# Altium schematic sheet 03.Template_Debug.SchDoc
size 209 x 297 mm; Author: Мурашкин Д.В.; CompanyName: Innoforce.kz; DocumentNumber: AB_BUSM_D01.R1; SheetNumber: 9; SheetTotal: 20; Scale: 1:1; Letter1Column: Э; PartName: Разъём программирования и отладки; DocumentsNumber: AB_BUSM_D01.R1
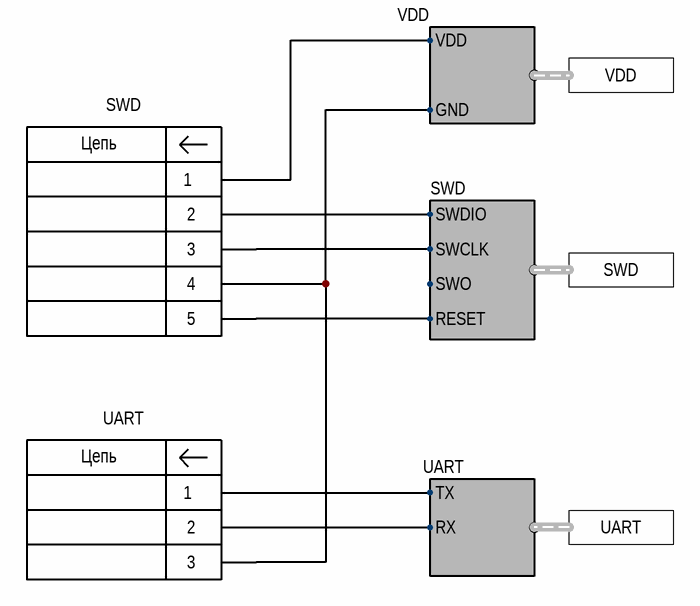
[diagram p0: 03.Template_Debug.SchDoc]

## Parts
SWD  SWDR-2.54-5  [SWDR-2.54-5]  (value not drawn)  (no BOM)
UART  UART-2.54-3  [UART-2.54-3]  (value not drawn)  (no BOM)

## Ports
SWD (harness SWD), UART (harness UART), VDD (harness VDD)

## Harnesses
SWD: SWCLK, SWO, SWDIO, RESET
VDD: VDD, GND
UART: TX, RX

## Nets
NetSWD_1: SWD.1 ; port VDD.VDD
NetSWD_2: SWD.2 ; port SWD.SWDIO
NetSWD_3: SWD.3 ; port SWD.SWCLK
NetSWD_4: SWD.4 UART.3 ; port VDD.GND
NetSWD_5: SWD.5 ; port SWD.RESET
NetUART_1: UART.1 ; port UART.TX
NetUART_2: UART.2 ; port UART.RX

## Notes on the sheet
- Подп. и дата
- Инв. № дубл.
- Взам. инв. №
- Инв. № подл.
- Изм.
- Лист
- № докум.
- Подп.
- Дата
- 2.106-A4
- Копировал
- Формат А4
- (in symbol SWDR-2.54-5) Цепь
- (in symbol UART-2.54-3) Цепь

## Library data of the parts
SWD = SWDR-2.54-5: Connector Debug SWD + Reset PCB-PAD-2.54-5; Pitch: 2.54; Row spacing: 0; Positions: 5; Rows: 1; Placing: Vertical; Connector type: Board pads; Connector style: Board; Shrouding: Not; Group: Mechanical; Component: Connectors; Item ID: SWDR-2.54-5; Part name: SWDR-2.54-5; Package: PCB-PAD-2.54-5; Contact type: Board hole pad; Series name: SWD; Width: 3.0mm; Length: 13.2mm; Height: 0.0mm; Mounting type: Through hole; Category: Debug
UART = UART-2.54-3: Connector Debug UART PCB-PAD-2.54-3; Pitch: 2.54; Row spacing: 0; Positions: 3; Rows: 1; Placing: Vertical; Series name: Serial; Connector type: Board pads; Connector style: Board; Shrouding: Not; Group: Mechanical; Component: Connectors; Item ID: UART-2.54-3; Part name: UART-2.54-3; Package: PCB-PAD-2.54-3; Contact type: Board hole pad; Width: 3.0mm; Length: 8.0mm; Height: 0.0mm; Mounting type: Through hole; Category: Debug